# Altium schematic sheet minSystem.SchDoc
size A4
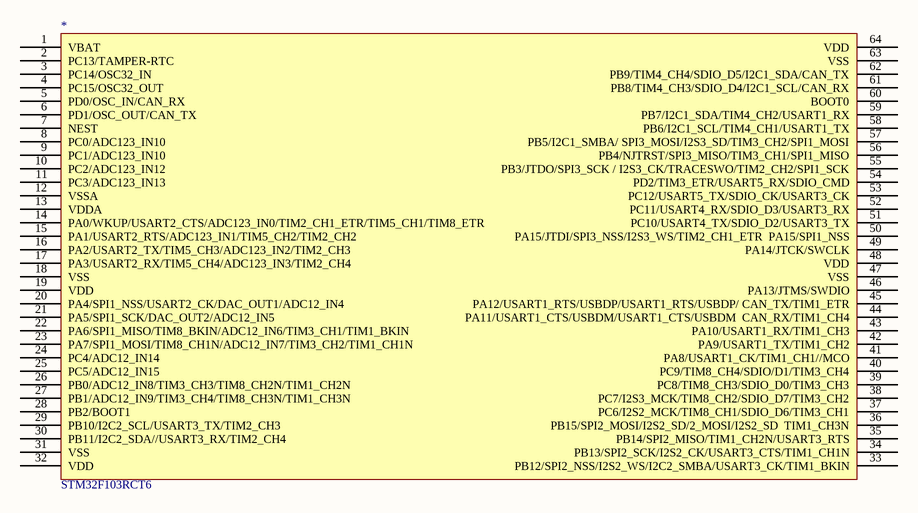
[diagram p0: minSystem.SchDoc]

## Parts
*  STM32F103RCT6

## Nets

Not connected (* = marked no-connect by the designer): * 1(VBAT) 2(PC13/TAMPER-RTC) 3(PC14/OSC32_IN) 4(PC15/OSC32_OUT) 5(PD0/OSC_IN/CAN_RX) 6(PD1/OSC_OUT/CAN_TX) 7(NEST) 8(PC0/ADC123_IN10) 9(PC1/ADC123_IN10) 10(PC2/ADC123_IN12) 11(PC3/ADC123_IN13) 12(VSSA) 13(VDDA) 14(PA0/WKUP/USART2_CTS/ADC123_IN0/TIM2_CH1_ETR/TIM5_CH1/TIM8_ETR) 15(PA1/USART2_RTS/ADC123_IN1/TIM5_CH2/TIM2_CH2) 16(PA2/USART2_TX/TIM5_CH3/ADC123_IN2/TIM2_CH3) 17(PA3/USART2_RX/TIM5_CH4/ADC123_IN3/TIM2_CH4) 18(VSS) 19(VDD) 20(PA4/SPI1_NSS/USART2_CK/DAC_OUT1/ADC12_IN4) 21(PA5/SPI1_SCK/DAC_OUT2/ADC12_IN5) 22(PA6/SPI1_MISO/TIM8_BKIN/ADC12_IN6/TIM3_CH1/TIM1_BKIN) 23(PA7/SPI1_MOSI/TIM8_CH1N/ADC12_IN7/TIM3_CH2/TIM1_CH1N) 24(PC4/ADC12_IN14) 25(PC5/ADC12_IN15) 26(PB0/ADC12_IN8/TIM3_CH3/TIM8_CH2N/TIM1_CH2N) 27(PB1/ADC12_IN9/TIM3_CH4/TIM8_CH3N/TIM1_CH3N) 28(PB2/BOOT1) 29(PB10/I2C2_SCL/USART3_TX/TIM2_CH3) 30(PB11/I2C2_SDA//USART3_RX/TIM2_CH4) 31(VSS) 32(VDD) 33(PB12/SPI2_NSS/I2S2_WS/I2C2_SMBA/USART3_CK/TIM1_BKIN) 34(PB13/SPI2_SCK/I2S2_CK/USART3_CTS/TIM1_CH1N) 35(PB14/SPI2_MISO/TIM1_CH2N/USART3_RTS) 36(PB15/SPI2_MOSI/I2S2_SD/2_MOSI/I2S2_SD__TIM1_CH3N) 37(PC6/I2S2_MCK/TIM8_CH1/SDIO_D6/TIM3_CH1) 38(PC7/I2S3_MCK/TIM8_CH2/SDIO_D7/TIM3_CH2) 39(PC8/TIM8_CH3/SDIO_D0/TIM3_CH3) 40(PC9/TIM8_CH4/SDIO/D1/TIM3_CH4) 41(PA8/USART1_CK/TIM1_CH1//MCO) 42(PA9/USART1_TX/TIM1_CH2) 43(PA10/USART1_RX/TIM1_CH3) 44(PA11/USART1_CTS/USBDM/USART1_CTS/USBDM__CAN_RX/TIM1_CH4) 45(PA12/USART1_RTS/USBDP/USART1_RTS/USBDP/_CAN_TX/TIM1_ETR) 46(PA13/JTMS/SWDIO) 47(VSS) 48(VDD) 49(PA14/JTCK/SWCLK) 50(PA15/JTDI/SPI3_NSS/I2S3_WS/TIM2_CH1_ETR__PA15/SPI1_NSS) 51(PC10/USART4_TX/SDIO_D2/USART3_TX) 52(PC11/USART4_RX/SDIO_D3/USART3_RX) 53(PC12/USART5_TX/SDIO_CK/USART3_CK) 54(PD2/TIM3_ETR/USART5_RX/SDIO_CMD) 55(PB3/JTDO/SPI3_SCK_/_I2S3_CK/TRACESWO/TIM2_CH2/SPI1_SCK) 56(PB4/NJTRST/SPI3_MISO/TIM3_CH1/SPI1_MISO) 57(PB5/I2C1_SMBA/_SPI3_MOSI/I2S3_SD/TIM3_CH2/SPI1_MOSI) 58(PB6/I2C1_SCL/TIM4_CH1/USART1_TX) 59(PB7/I2C1_SDA/TIM4_CH2/USART1_RX) 60(BOOT0) 61(PB8/TIM4_CH3/SDIO_D4/I2C1_SCL/CAN_RX) 62(PB9/TIM4_CH4/SDIO_D5/I2C1_SDA/CAN_TX) 63(VSS) 64(VDD)